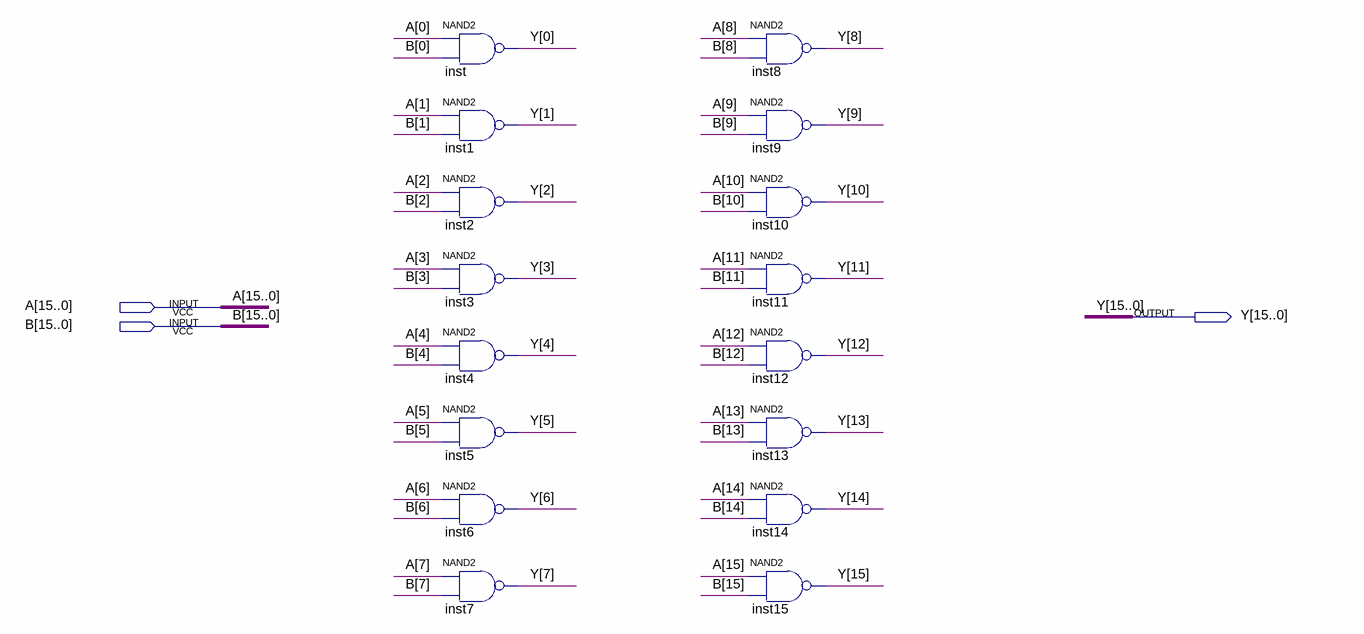
[diagram p0: schematic sheet]
// Quartus schematic nand16bit.bdf as structural Verilog: 16 symbols, 3 pins
module nand16bit (
  input  [15:0] A,
  input  [15:0] B,
  output [15:0] Y
);

  nand inst (Y[0], A[0], B[0]);
  nand inst1 (Y[1], A[1], B[1]);
  nand inst2 (Y[2], A[2], B[2]);
  nand inst3 (Y[3], A[3], B[3]);
  nand inst4 (Y[4], A[4], B[4]);
  nand inst5 (Y[5], A[5], B[5]);
  nand inst6 (Y[6], A[6], B[6]);
  nand inst7 (Y[7], A[7], B[7]);
  nand inst8 (Y[8], A[8], B[8]);
  nand inst9 (Y[9], A[9], B[9]);
  nand inst10 (Y[10], A[10], B[10]);
  nand inst11 (Y[11], A[11], B[11]);
  nand inst12 (Y[12], A[12], B[12]);
  nand inst13 (Y[13], A[13], B[13]);
  nand inst14 (Y[14], A[14], B[14]);
  nand inst15 (Y[15], A[15], B[15]);
endmodule
